# EAGLE design square Rev2 (EAGLE 9.0.1)
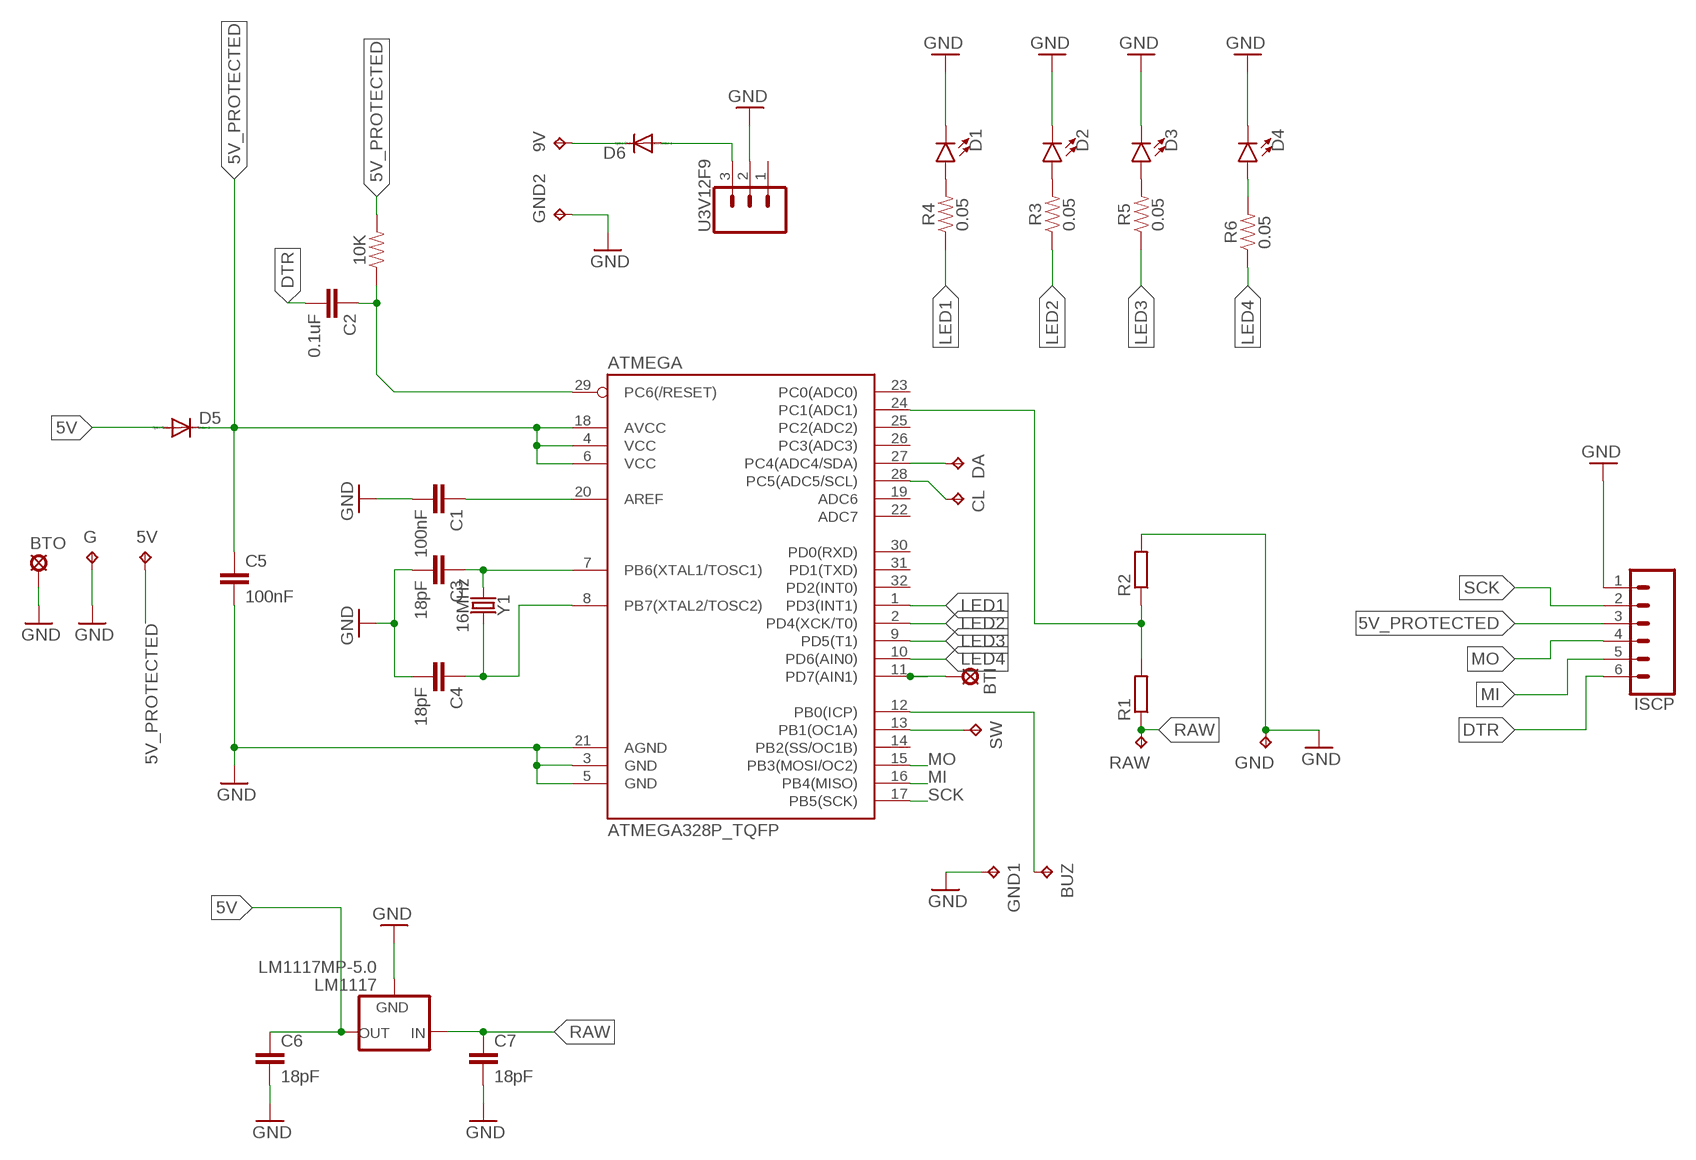
[diagram p0: schematic, sheet 1]

## Parts
5V  TPB1,27  [B1,27]
9V  TPB2,54  [B2,54]
10K  0.27OHM-0603-1/10W-1%  [0603]
ATMEGA  ATMEGA328P_TQFP  [TQFP32-08]
BTI  LSP10  [LSP10]
BTO  LSP10  [LSP10]
BUZ  TPB2,54  [B2,54]
C1  100nF  10NF-0603-50V-10%  [0603]
C2  0.1uF  10NF-0603-50V-10%  [0603]
C3  18pF  10NF-0603-50V-10%  [0603]
C4  18pF  10NF-0603-50V-10%  [0603]
C5  100nF  10NF-0603-50V-10%  [0603]
C6  18pF  10NF-0603-50V-10%  [0603]
C7  18pF  10NF-0603-50V-10%  [0603]
CL  TPB1,27  [B1,27]
D1  LED1206  [LED-1206]
D2  LED1206  [LED-1206]
D3  LED1206  [LED-1206]
D4  LED1206  [LED-1206]
D5  DIODE-SOD106A-R  [SOD106A-R]
D6  DIODE-SOD106A-R  [SOD106A-R]
DA  TPB1,27  [B1,27]
G  TPB1,27  [B1,27]
GND  TPB2,54  [B2,54]
GND1  TPB2,54  [B2,54]
GND2  TPB2,54  [B2,54]
ISCP  CONN_06SMD-1MM  [1X06-1MM]
LM1117  LM1117MP-5.0  [SOT223]
R1  R-EU_R1206  [R1206]
R2  R-EU_R1206  [R1206]
R3  0.05  0.05OHM-0603-1/5W-1%  [0603]
R4  0.05  0.05OHM-0603-1/5W-1%  [0603]
R5  0.05  0.05OHM-0603-1/5W-1%  [0603]
R6  0.05  0.05OHM-0603-1/5W-1%  [0603]
RAW  TPB2,54  [B2,54]
SW  TPB1,27  [B1,27]
U3V12F9  CONN_03  [1X03]
Y1  16MHz  CRYSTALSMD-5X3.2-2PAD  [CRYSTAL-SMD-5X3.2-2PAD]

## Nets
5V [power]: C6.1 D5.A LM1117.2(OUT) LM1117.4(OUT)
5V_PROTECTED [power]: 5V.TP 10K.2 ATMEGA.4(VCC) ATMEGA.6(VCC) ATMEGA.18(AVCC) C5.1 D5.C ISCP.3
9VOUT [9v]: D6.A U3V12F9.3
AREF: ATMEGA.20(AREF) C1.1
BUZZER: ATMEGA.12(PB0(ICP)) BUZ.TP
DTR: C2.2 ISCP.6
GND [power]: ATMEGA.3(GND) ATMEGA.5(GND) ATMEGA.21(AGND) BTO.MP C1.2 C3.2 C4.2 C5.2 C6.2 C7.2 D1.C D2.C D3.C D4.C G.TP GND1.TP GND2.TP GND.TP ISCP.1 LM1117.1(GND) R2.2 U3V12F9.2
GREEN1: D2.A R3.2
GREEN2: D3.A R5.2
GREEN3: D4.A R6.2
LED1: ATMEGA.1(PD3(INT1)) R4.1
LED2: ATMEGA.2(PD4(XCK/T0)) R3.1
LED3: ATMEGA.9(PD5(T1)) R5.1
LED4: ATMEGA.10(PD6(AIN0)) R6.1
MI: ATMEGA.16(PB4(MISO)) ISCP.5
MO: ATMEGA.15(PB3(MOSI/OC2)) ISCP.4
N$2: ATMEGA.13(PB1(OC1A)) SW.TP
N$3: ATMEGA.11(PD7(AIN1)) BTI.MP
N$21 [9v]: 9V.TP D6.C
RAW [9v]: C7.1 LM1117.3(IN) R1.1 RAW.TP
RED: D1.A R4.2
RESET: 10K.1 ATMEGA.29(PC6(/RESET)) C2.1
SCK: ATMEGA.17(PB5(SCK)) ISCP.2
SCL: ATMEGA.28(PC5(ADC5/SCL)) CL.TP
SDA: ATMEGA.27(PC4(ADC4/SDA)) DA.TP
VOLTSENS: ATMEGA.24(PC1(ADC1)) R1.2 R2.1
XTAL1: ATMEGA.7(PB6(XTAL1/TOSC1)) C3.1 Y1.P$1
XTAL2: ATMEGA.8(PB7(XTAL2/TOSC2)) C4.1 Y1.P$2
Unconnected: ATMEGA.14(PB2(SS/OC1B)) ATMEGA.19(ADC6) ATMEGA.22(ADC7) ATMEGA.23(PC0(ADC0)) ATMEGA.25(PC2(ADC2)) ATMEGA.26(PC3(ADC3)) ATMEGA.30(PD0(RXD)) ATMEGA.31(PD1(TXD)) ATMEGA.32(PD2(INT0)) U3V12F9.1

## Library data of the parts
5V 9V BUZ CL DA G GND GND1 GND2 RAW SW = testpad:TP: Test pad
10K = SparkFun-Resistors:0.27OHM: 0.27Ω resistor A resistor is a passive two-terminal electrical component that implements electrical resistance as a circuit element. Resistors act to reduce current flow, and, at the same time, act to lower voltage levels within circuits. - Wikipedia; PROD_ID: RES-08787; VALUE: 0.27
ATMEGA = SparkFun-IC-Microcontroller:ATMEGA328P_TQFP: Popular 328P in QFP Storefront component: ATmega328 - TQFP <https://www.sparkfun.com/products/13448> (COM-13448) Datasheet <http://www.sparkfun.com/datasheets/Components/SMD/ATMega328.pdf> SparkFun Products SparkFun RedBoard - Programmed with Arduino <https://www.sparkfun.com/products/12757> (DEV-12757) Arduino Pro Mini 328 - 5V/16MHz <https://www.sparkfun.com/products/11113> (DEV-11113) Arduino Pro Mini 328 - 3.3V/8MHz <https://www.sparkfun.com/products/11114> (DEV-11114) SparkFun OpenLog <https://www.sparkfun.com/products/13712> (DEV-13712) SparkFun MicroView - OLED Arduino Module <https://www.sparkfun.com/products/12923> (DEV-12923) SparkFun Digital Sandbox <https://www.sparkfun.com/products/12651> (DEV-12651) SparkFun PicoBoard <https://www.sparkfun.com/products/11888> (WIG-11888) Arduino Fio <https://www.sparkfun.com/products/10116> (DEV-10116) LilyPad Arduino 328 Main Board <https://www.sparkfun.com/products/13342> (DEV-13342) SparkFun RedStick <https://www.sparkfun.com/products/13741> (DEV-13741) LilyPad MP3 <https://www.sparkfun.com/products/11013> (DEV-11013) LilyPad Arduino SimpleSnap <https://www.sparkfun.com/products/10941> (DEV-10941) SparkFun Stepoko <https://www.sparkfun.com/products/13899> (ROB-13899) SparkFun Geiger Counter <https://www.sparkfun.com/products/11345> (SEN-11345) SparkFun EL Sequencer <https://www.sparkfun.com/products/12781> (COM-12781) Arduino Pro 328 - 5V/16MHz <https://www.sparkfun.com/products/10915> (DEV-10915) CryptoCape <https://www.sparkfun.com/products/12773> (DEV-12773) SparkFun IR Thermometer Evaluation Board - MLX90614 <https://www.sparkfun.com/products/10740> (SEN-10740) SparkFun RedBot Mainboard <https://www.sparkfun.com/products/12097> (ROB-12097) Arduino Pro 328 - 3.3V/8MHz <https://www.sparkfun.com/products/10914> (DEV-10914) SparkFun Block for Intel® Edison - Arduino <https://www.sparkfun.com/products/13036> (DEV-13036) SparkFun Simon Says - Surface Mount Soldering Kit <https://www.sparkfun.com/products/10935> (KIT-10935) SparkFun 7-Segment Serial Display - Red <https://www.sparkfun.com/products/11441> (COM-11441) SparkFun 7-Segment Serial Display - White <https://www.sparkfun.com/products/11629> (COM-11629) SparkFun 7-Segment Serial Display - Yellow <https://www.sparkfun.com/products/11443> (COM-11443) SparkFun 7-Segment Serial Display - Kelly Green <https://www.sparkfun.com/products/11440> (COM-11440) SparkFun 7-Segment Serial Display - Blue <https://www.sparkfun.com/products/11442> (COM-11442) SparkFun OpenSegment Serial Display - 20mm (Blue) <https://www.sparkfun.com/products/11647> (COM-11647) SparkFun OpenSegment Serial Display - 20mm (Green) <https://www.sparkfun.com/products/11646> (COM-11646) SparkFun OpenSegment Serial Display - 20mm (White) <https://www.sparkfun.com/products/11648> (COM-11648) SparkFun OpenSegment Serial Display - 20mm (Red) <https://www.sparkfun.com/products/11644> (COM-11644) SparkFun OpenSegment Serial Display - 20mm (Yellow) <https://www.sparkfun.com/products/11645> (COM-11645) SparkFun OpenSegment Shield <https://www.sparkfun.com/products/13190> (DEV-13190); PROD_ID: IC-09069
BTI BTO = solpad:LSP10: SOLDER PAD drill 1.0 mm, distributor Buerklin, 12H555
C1-C7 = SparkFun-Capacitors:10NF: 0.01uF/10nF/10,000pF ceramic capacitors A capacitor is a passive two-terminal electrical component used to store electrical energy temporarily in an electric field. CAP-09321; PROD_ID: CAP-00867; VALUE: 10nF
D1-D4 = SparkFun-LED:LED: LED (Generic) Standard schematic elements and footprints for 5mm, 3mm, 1206, and 0603 sized LEDs. Generic LEDs with no color specified.
D5 D6 = diode:DIODE-: DIODE
ISCP = SparkFun-Connectors:CONN_06: Multi connection point. Often used as Generic Header-pin footprint for 0.1 inch spaced/style header connections On any of the 0.1 inch spaced packages, you can populate with these: Break Away Headers - Straight <https://www.sparkfun.com/products/116> (PRT-00116) Break Away Male Headers - Right Angle <https://www.sparkfun.com/products/553> (PRT-00553) Female Headers <https://www.sparkfun.com/products/115> (PRT-00115) Break Away Headers - Machine Pin <https://www.sparkfun.com/products/117> (PRT-00117) Break Away Female Headers - Swiss Machine Pin <https://www.sparkfun.com/products/743> (PRT-00743) Arduino Stackable Header - 6 Pin <https://www.sparkfun.com/products/9280> (PRT-09280) For SCREWTERMINALS and SPRING TERMINALS visit here: Screw Terimnals on SparkFun.com <https://www.sparkfun.com/search/results?term=Screw+Terminals> (5mm/3.5mm/2.54mm spacing) This device is also useful as a general connection point to wire up your design to another part of your project. Our various solder wires solder well into these plated through hole pads. Hook-Up Wire - Assortment (Stranded, 22 AWG) <https://www.sparkfun.com/products/11375> (PRT-11375) Hook-Up Wire - Assortment (Solid Core, 22 AWG) <https://www.sparkfun.com/products/11367> (PRT-11367) View the entire wire category on our website here <https://www.sparkfun.com/categories/141>; PROD_ID: CONN-08249; SF_ID: GPS-00579
LM1117 = lm1117_10:LM1117?-*: 800mA Low-Dropout Linear Regulator Source: http://www.ti.com/lit/ds/symlink/lm1117-n.pdf; MF: Texas Instruments; MPN: LM1117MP-5.0; OC_FARNELL: 9778209; OC_NEWARK: 28X3417
R1 R2 = Clean-Kong:R-EU_: RESISTOR, European symbol
R3-R6 = SparkFun-Resistors:0.05OHM: 0.05Ω resistor A resistor is a passive two-terminal electrical component that implements electrical resistance as a circuit element. Resistors act to reduce current flow, and, at the same time, act to lower voltage levels within circuits. - Wikipedia; PROD_ID: RES-12535
U3V12F9 = SparkFun-Connectors:CONN_03: Multi connection point. Often used as Generic Header-pin footprint for 0.1 inch spaced/style header connections On any of the 0.1 inch spaced packages, you can populate with these: Break Away Headers - Straight <https://www.sparkfun.com/products/116> (PRT-00116) Break Away Male Headers - Right Angle <https://www.sparkfun.com/products/553> (PRT-00553) Female Headers <https://www.sparkfun.com/products/115> (PRT-00115) Break Away Headers - Machine Pin <https://www.sparkfun.com/products/117> (PRT-00117) Break Away Female Headers - Swiss Machine Pin <https://www.sparkfun.com/products/743> (PRT-00743) Stackable Header - 3 Pin (Female, 0.1") <https://www.sparkfun.com/products/13875> (PRT-13875) For SCREWTERMINALS and SPRING TERMINALS visit here: Screw Terimnals on SparkFun.com <https://www.sparkfun.com/search/results?term=Screw+Terminals> (5mm/3.5mm/2.54mm spacing) This device is also useful as a general connection point to wire up your design to another part of your project. Our various solder wires solder well into these plated through hole pads. Hook-Up Wire - Assortment (Stranded, 22 AWG) <https://www.sparkfun.com/products/11375> (PRT-11375) Hook-Up Wire - Assortment (Solid Core, 22 AWG) <https://www.sparkfun.com/products/11367> (PRT-11367) View the entire wire category on our website here <https://www.sparkfun.com/categories/141> Special notes: Molex polarized connector foot print use with SKU : PRT-08232 with associated crimp pins and housings.
Y1 = SparkFun-Clocks:CRYSTAL: Crystals (Generic) These are passive quartz crystals, which can be used as a clock source for a microcontroller. Crystal's are two-terminal devices. They require external "load" capacitors to generate an oscillating signal.

## Module VCC
Ports: 

### Library data of the parts

## Net classes
0 default: width 0.2 mm, drill 0.254 mm, clearance 0.16 mm
1 power: width 0.3 mm, drill 0.3 mm, clearance 0.2 mm
2 9v: width 0.399 mm, drill 0.399 mm, clearance 0.3 mm

## Board
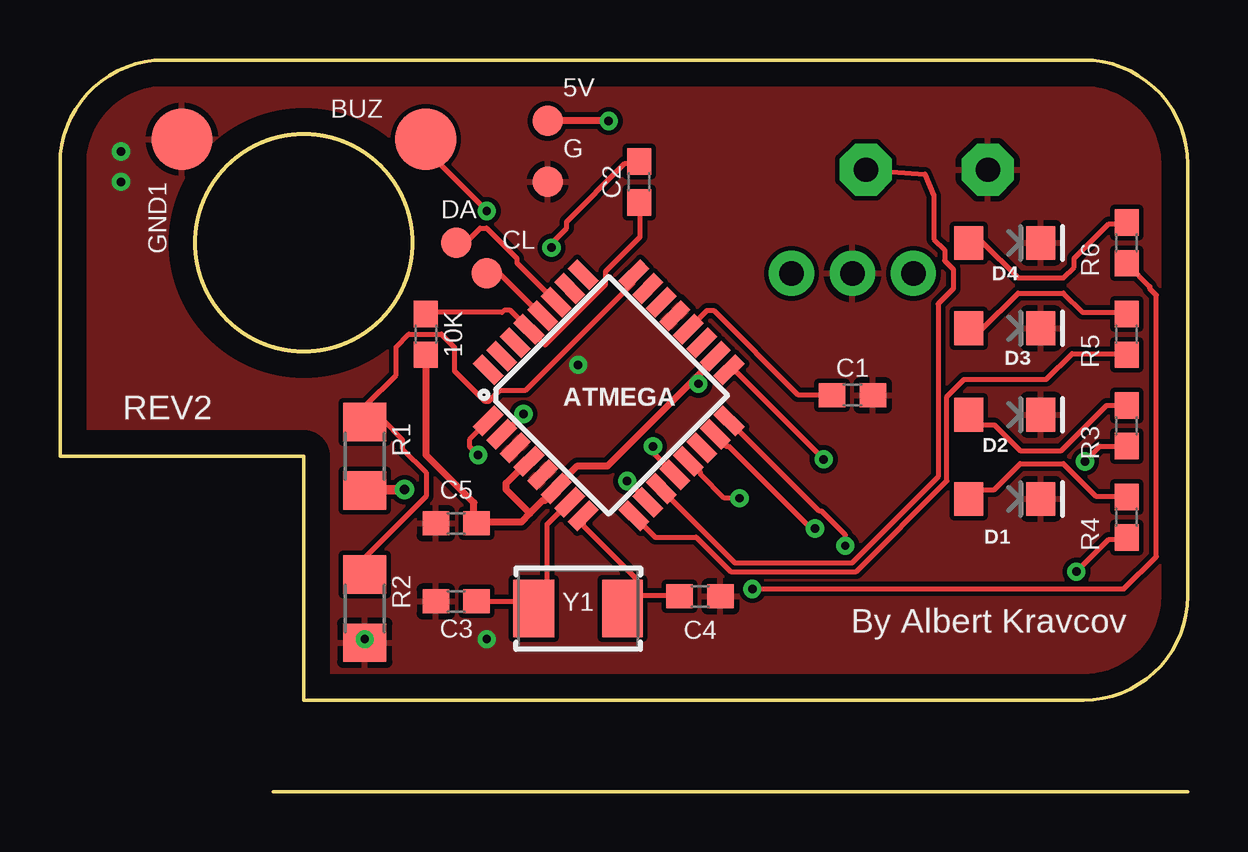
[diagram p1: board, top side]
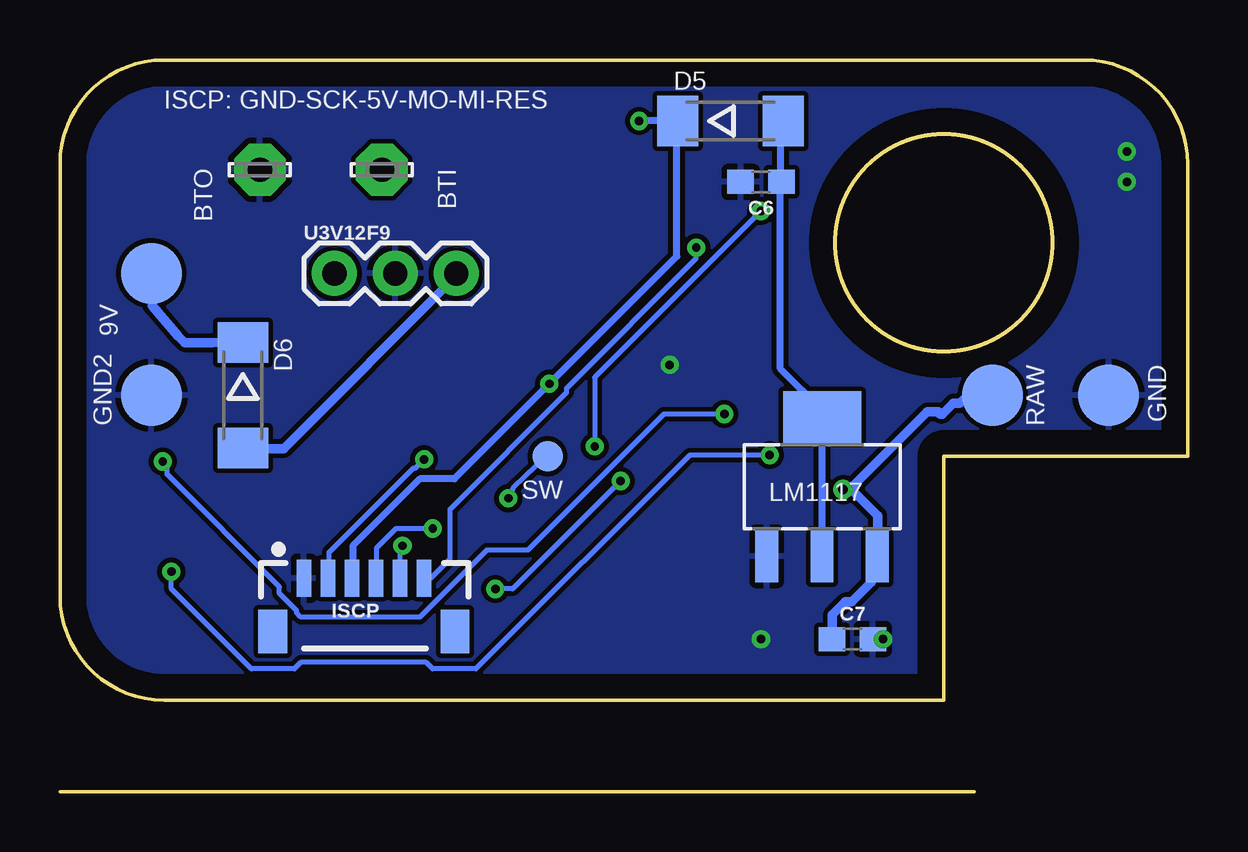
[diagram p2: board, bottom side, seen from below]

Size 46.99 x 30.48 mm. Coordinates in mm from the lower left corner, seen from the top.
Outline: 0,13.97 0,26.14 arc-90 4.34,30.48 42.65,30.48 arc-90 46.99,26.14 46.99,8.15 arc-90 42.65,3.81 10.16,3.81 10.16,13.97 0,13.97
Outline: circle at 10.16,22.86 radius 4.52
Copper layers (1*16): Top 0.035mm / dielectric 1.5mm / Bottom 0.035mm
Design rules "default *": minimum track width 6mil, minimum drill 0.35mm, track to track 6mil, track to pad 6mil, pad to pad 6mil, via to via 6mil, smd to smd 6mil, copper to edge 40mil, drill to drill 6mil, minimum pad ring 10mil, minimum via ring 8mil, stop-mask expansion 4mil, vias tented up to drill 2mm, thermal gap 10mil

### Footprints (pad centres in the part's own frame; a part is rotated, then mirrored left to right if it is on the bottom)
B1,27 = smd 1.27 x 1.27: TP 0,0
B2,54 = smd 2.54 x 2.54: TP 0,0
0603 = smd 1.1 x 1: 1 -0.85,0; 2 0.85,0
TQFP32-08 = smd 1.27 x 0.559: 1 -4.293,2.8; 2 -4.293,2; 3 -4.293,1.2; 4 -4.293,0.4; 5 -4.293,-0.4; 6 -4.293,-1.2; 7 -4.293,-2; 8 -4.293,-2.8; 17 4.293,-2.8; 18 4.293,-2; 19 4.293,-1.2; 20 4.293,-0.4; 21 4.293,0.4; 22 4.293,1.2; 23 4.293,2; 24 4.293,2.8 | smd 0.559 x 1.27: 9 -2.8,-4.293; 10 -2,-4.293; 11 -1.2,-4.293; 12 -0.4,-4.293; 13 0.4,-4.293; 14 1.2,-4.293; 15 2,-4.293; 16 2.8,-4.293; 25 2.8,4.293; 26 2,4.293; 27 1.2,4.293; 28 0.4,4.293; 29 -0.4,4.293; 30 -1.2,4.293; 31 -2,4.293; 32 -2.8,4.293
LSP10 = drill 1.016 pad 2.159 octagon: MP 0,0
LED-1206 = smd 1.2 x 1.4: A -1.5,0; C 1.5,0
SOD106A-R = smd 1.7 x 2.1: A 2.2,0; C -2.2,0
1X06-1MM = smd 0.6 x 1.55: 1 -2.54,1.27; 2 -1.54,1.27; 3 -0.54,1.27; 4 0.46,1.27; 5 1.46,1.27; 6 2.46,1.27 | smd 1.2 x 1.8: P$1 -3.84,-0.955; P$2 3.76,-0.955
SOT223 = smd 0.95 x 2.15: 1 -2.3,-2.9; 2 0,-2.9; 3 2.3,-2.9 | smd 3.25 x 2.15: 4 0,2.9
R1206 = smd 1.6 x 1.803: 1 -1.422,0; 2 1.422,0
1X03 = drill 1.016 pad 1.88: 1 0,0; 2 2.54,0; 3 5.08,0
CRYSTAL-SMD-5X3.2-2PAD = smd 1.7 x 2.4: P$1 1.85,0; P$2 -1.85,0

### Placement (x,y rotation side)
5V  20.32,27.94 0 top
9V  43.18,21.59 0 bottom
10K  15.24,19.05 270 top
ATMEGA  22.86,16.51 45 top
BTI  33.58,25.91 0 bottom
BTO  38.66,25.91 0 bottom
BUZ  15.24,27.18 90 top
C1  33.02,16.51 0 top
C2  24.13,25.4 90 top
C3  16.51,7.92 180 top
C4  26.67,8.13 0 top
C5  16.51,11.18 180 top
C6  17.78,25.4 180 bottom
C7  13.97,6.35 0 bottom
CL  17.78,21.59 0 top
D1  39.37,12.19 0 top
D2  39.37,15.7 0 top
D3  39.37,19.3 0 top
D4  39.37,22.86 0 top
D5  19.05,27.94 0 bottom
D6  39.37,16.51 270 bottom
DA  16.51,22.86 0 top
G  20.32,25.4 0 top
GND  3.3,16.51 0 bottom
GND1  5.08,27.18 180 top
GND2  43.18,16.51 0 bottom
ISCP  34.29,7.62 0 bottom
LM1117  15.24,12.7 0 bottom
R1  12.7,13.97 90 top
R2  12.7,7.62 270 top
R3  44.45,15.24 90 top
R4  44.45,11.43 90 top
R5  44.45,19.05 90 top
R6  44.45,22.86 90 top
RAW  8.13,16.51 180 bottom
SW  26.67,13.97 180 bottom
U3V12F9  35.56,21.59 0 bottom
Y1  21.59,7.62 180 top

### Tracks (layer width: path | path; a pad name or v marks a point on that pad's centre or on a via)
5V
  Bottom 0.3: D5.A 16.88,27.88 16.97,27.79 16.97,25.45 C6.1 16.97,25.27 16.97,17.62 15.26,15.91 15.26,15.73 LM1117.4 15.26,15.55 15.26,9.88 LM1117.2
5V_PROTECTED  (via drill 0.35)
  Top 0.3: 19.58,11.59 20.12,12.13 20.21,12.13 20.66,12.58 ATMEGA.6 20.75,12.76 21.56,13.57 22.82,13.57 26.42,17.17 | 19.58,11.59 19.22,11.23 17.42,11.23 C5.1 17.24,11.23 17.24,12.04 15.26,14.02 15.26,18.16 10K.2 | 19.58,11.59 18.59,12.58 18.59,12.85 19.49,13.75 ATMEGA.4 | 26.42,17.17 26.87,17.62 26.87,17.71 27.23,18.07 ATMEGA.18 | v26.6,16.99 26.42,17.17 | v22.86,27.94 5V.TP
  Bottom 0.3: ISCP.3 34.79,8.89 34.79,10.24 32,13.03 30.56,13.03 v26.6,16.99 21.29,22.3 21.29,27.88 D5.C v22.86,27.94
9VOUT
  Bottom 0.399: D6.A 39.37,14.29 37.67,14.29 30.56,21.4 30.56,21.58 U3V12F9.3
AREF
  Top 0.2: C1.1 32.09,16.54 30.74,16.54 27.23,20.05 26.96,20.05 26.24,19.33 ATMEGA.20
BUZZER  (via drill 0.35)
  Top 0.2: v24.71,14.38 24.71,14.11 25.61,13.21 ATMEGA.12 | v17.78,24.19 15.26,26.71 15.26,27.16 BUZ.TP
  Bottom 0.2: v24.71,14.38 24.71,17.26 v17.78,24.19
DTR  (via drill 0.35)
  Top 0.2: v20.48,22.66 20.48,22.84 21.11,23.47 21.11,23.74 23.54,26.17 24.08,26.17 C2.2
  Bottom 0.2: v20.48,22.66 20.48,22.21 25.88,16.81 25.88,16.63 30.74,11.77 30.74,9.7 31.55,8.89 ISCP.6
GND  (via drill 0.35)
  other vias: 12.7,6.35 17.78,6.35 21.59,17.78 2.54,26.67 2.54,25.4
  pour Top: -5.08,31.75 53.34,33.02 53.34,-2.54 -5.08,-5.08
  pour Bottom: -3.81,-2.54 -3.81,40.64 50.8,40.64 50.8,-2.54
GREEN1
  Top 0.2: R3.2 43.61,16.09 41.72,14.2 40.01,14.2 38.93,15.28 38.3,15.28 37.94,15.64 D2.A
GREEN2
  Top 0.2: R5.2 44.42,19.96 42.62,19.96 41.81,20.77 39.92,20.77 38.39,19.24 37.94,19.24 D3.A
GREEN3
  Top 0.2: R6.2 44.42,23.65 43.7,23.65 42.26,22.21 42.26,21.85 41.81,21.4 39.92,21.4 38.39,22.93 37.94,22.93 D4.A
LED1  (via drill 0.35)
  Top 0.2: v42.35,9.16 43.7,10.51 44.42,10.51 R4.1 | v17.42,14.02 17.06,14.38 17.06,14.65 17.78,15.37 ATMEGA.1
  Bottom 0.2: v42.35,9.16 42.35,8.44 39.02,5.11 37.22,5.11 36.95,5.38 31.73,5.38 31.46,5.11 29.66,5.11 20.75,14.02 v17.42,14.02
LED2  (via drill 0.35)
  Top 0.2: v42.71,13.75 43.34,14.38 44.42,14.38 R3.1 | v19.31,15.73 18.5,14.92 ATMEGA.2
  Bottom 0.2: v42.71,13.75 42.53,13.57 42.53,13.21 37.85,8.53 37.85,8.26 37.13,7.54 37.13,7.45 36.95,7.27 32,7.27 29.21,10.06 27.5,10.06 21.83,15.73 v19.31,15.73
LED3
  Top 0.2: R5.1 44.42,18.25 42.17,18.25 41.09,17.17 37.67,17.17 36.95,16.45 36.95,12.94 33.17,9.16 27.95,9.16 26.51,10.6 24.8,10.6 23.99,11.41 ATMEGA.9
LED4  (via drill 0.35)
  Top 0.2: v28.85,8.44 44.33,8.44 45.68,9.79 45.68,20.68 45.41,20.95 45.41,21.04 44.51,21.94 R6.1 | v23.63,12.94 24.44,12.13 ATMEGA.10
  Bottom 0.2: v28.85,8.44 28.13,8.44 v23.63,12.94
MI  (via drill 0.35)
  Top 0.2: v32.72,10.24 32.72,10.69 31.73,11.68 31.64,11.68 27.95,15.37 ATMEGA.16
  Bottom 0.2: v32.72,10.24 32.81,10.15 32.81,8.89 ISCP.5
MO  (via drill 0.35)
  Top 0.2: v31.46,10.96 31.28,10.96 27.86,14.38 27.77,14.38 27.32,14.83 ATMEGA.15
  Bottom 0.2: v31.46,10.96 32.99,10.96 33.8,10.15 33.8,8.89 ISCP.4
N$2  (via drill 0.35)
  Top 0.2: v28.31,12.22 27.68,12.22 26.69,13.21 26.69,13.3 26.24,13.75 ATMEGA.13
  Bottom 0.2: v28.31,12.22 28.12,12.63 26.67,14.04 SW.TP
N$3
  Top 0.2: ATMEGA.11 25.07,12.58 28.13,9.52 32.99,9.52 36.59,13.12 36.59,20.32 37.22,20.95 37.22,21.76 36.86,22.12 36.86,22.57 36.41,23.02 36.41,24.82 36.04,25.72 33.5,25.9 BTI.MP
N$21
  Bottom 0.399: D6.C 40.64,18.7 41.8,18.7 42.07,18.97 43.15,20.24 9V.TP
RAW  (via drill 0.4)
  Top 0.399: v14.36,12.58 12.74,12.58 R1.1
  Bottom 0.399: C7.1 14.81,6.37 14.81,7.36 14.27,7.9 14,7.9 13.19,8.71 13.19,9.61 13.01,9.79 LM1117.3 12.92,9.97 12.92,11.5 14,12.58 | 14,12.58 v14.36,12.58 | RAW.TP 8.15,16.45 9.23,16.45 9.5,16.18 9.77,16.18 10.22,15.73 10.31,15.73 10.4,15.82 10.85,15.82 13.91,12.76 14,12.58
RED
  Top 0.2: R4.2 44.42,12.31 43.16,12.31 41.81,13.66 40.01,13.66 38.93,12.58 38.3,12.58 37.94,12.22 D1.A
RESET
  Top 0.2: 10K.1 15.26,19.96 18.41,19.96 18.5,20.05 18.77,20.05 19.49,19.33 ATMEGA.29 19.58,19.24 20.21,18.61 22.73,21.13 22.73,21.67 24.17,23.11 24.17,24.55 C2.1
SCK  (via drill 0.35)
  Top 0.2: v31.82,13.84 28.13,17.53 27.95,17.53 ATMEGA.17
  Bottom 0.2: v31.82,13.84 32.18,13.48 32.27,13.48 35.78,9.97 35.78,8.89 ISCP.2
SCL
  Top 0.2: CL.TP 18.32,21.58 20.03,19.87 ATMEGA.28
SDA
  Top 0.2: ATMEGA.27 20.66,20.41 19.04,22.03 19.04,22.21 17.78,23.47 17.51,23.47 16.97,22.93 16.52,22.93 DA.TP
VOLTSENS
  Top 0.2: ATMEGA.24 23.9,21.49 23.9,21.22 19.4,16.72 18.32,16.72 17.87,16.27 17.69,16.27 16.43,17.53 16.43,18.52 15.89,19.06 14.54,19.06 14,18.52 14,17.35 12.74,16.09 12.74,15.46 R1.2 12.83,15.46 13.46,15.46 14.27,14.65 14.27,14.29 15.26,13.3 15.26,12.31 12.74,9.79 12.74,9.07 R2.1
XTAL1
  Top 0.2: C3.1 17.42,7.9 19.4,7.9 19.67,7.63 Y1.P$1 19.49,7.9 20.3,8.71 20.3,11.14 21.2,12.04 ATMEGA.7
XTAL2
  Top 0.2: C4.1 25.79,8.17 23.99,8.17 Y1.P$2 24.08,8.26 24.08,8.8 21.83,11.05 21.83,11.41 ATMEGA.8

### Text on the board
tPlace: REV2 | By Albert Kravcov
bPlace: ISCP: GND-SCK-5V-MO-MI-RES